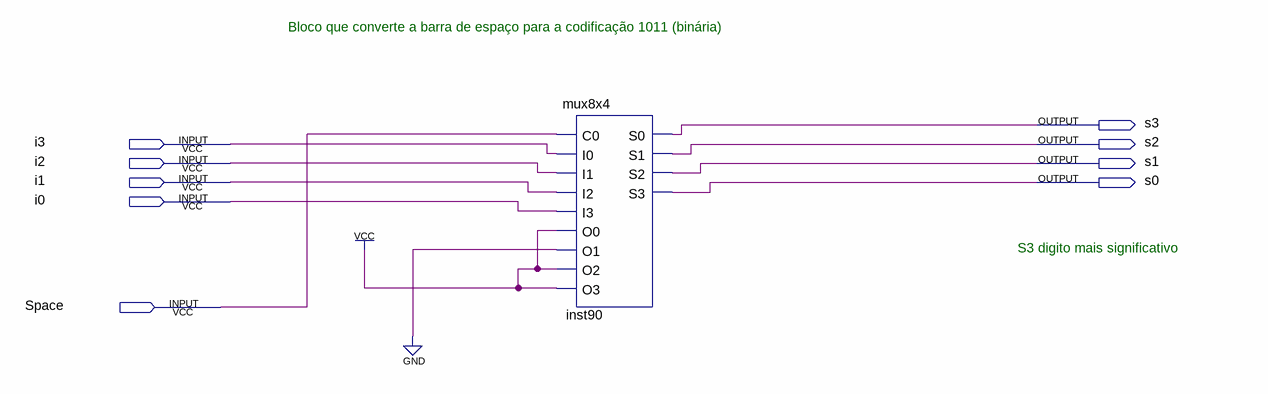
[diagram p0: schematic sheet]
// Quartus schematic Space.bdf as structural Verilog: 1 symbols, 9 pins
module Space (
  input  i3,
  input  i2,
  input  i1,
  input  i0,
  input  Space,
  output s3,
  output s2,
  output s1,
  output s0
);

  mux8x4 inst90 (
    .C0(Space), .I0(i3), .I1(i2), .I2(i1), .I3(i0), .O0(1'b1), .O1(1'b0), .O2(1'b1), .O3(1'b1), .S0(s3),
    .S1(s2), .S2(s1), .S3(s0));

  // Notes on the sheet:
  //   Bloco que converte a barra de espaço para a codificação 1011 (binária)
  //   S3 digito mais significativo
endmodule
